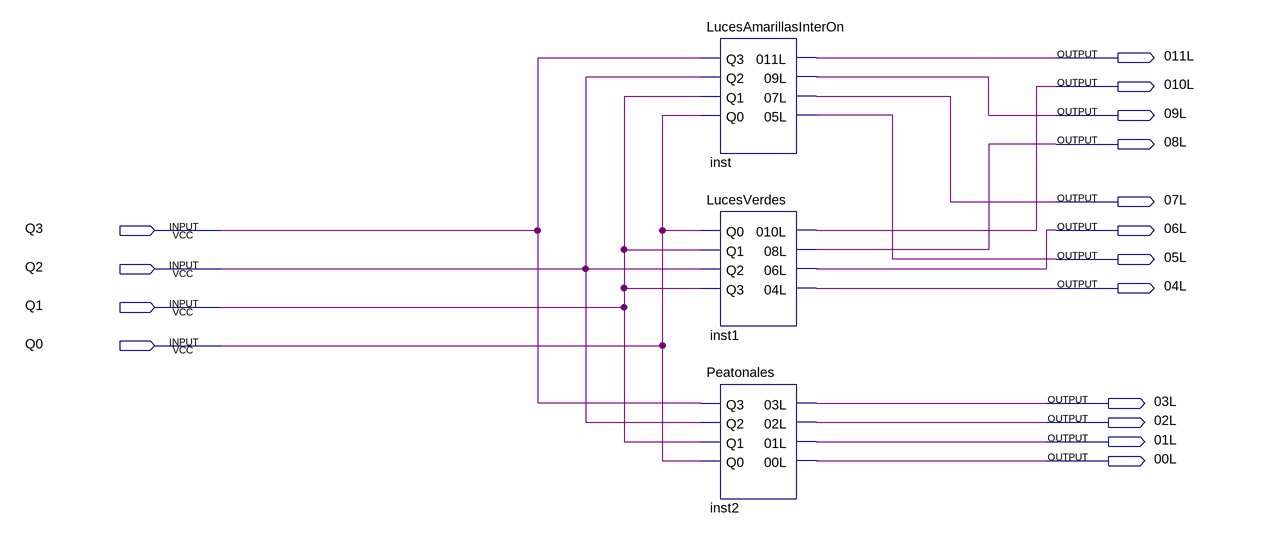
[diagram p0: schematic sheet]
// Quartus schematic luces.bdf as structural Verilog: 3 symbols, 16 pins
module luces (
  input  Q3,
  input  Q2,
  input  Q1,
  input  Q0,
  output \011L ,
  output \010L ,
  output \09L ,
  output \08L ,
  output \07L ,
  output \06L ,
  output \05L ,
  output \04L ,
  output \03L ,
  output \02L ,
  output \01L ,
  output \00L 
);

  LucesAmarillasInterOn inst (
    .Q3(Q3), .Q2(Q2), .Q1(Q1), .Q0(Q0), .\011L (\011L ), .\09L (\09L ), .\07L (\07L ), .\05L (\05L ));
  LucesVerdes inst1 (.Q0(Q0), .Q1(Q1), .Q2(Q2), .Q3(Q1), .\010L (\010L ), .\08L (\08L ), .\06L (\06L ), .\04L (\04L ));
  Peatonales inst2 (.Q3(Q3), .Q2(Q2), .Q1(Q1), .Q0(Q0), .\03L (\03L ), .\02L (\02L ), .\01L (\01L ), .\00L (\00L ));
endmodule
